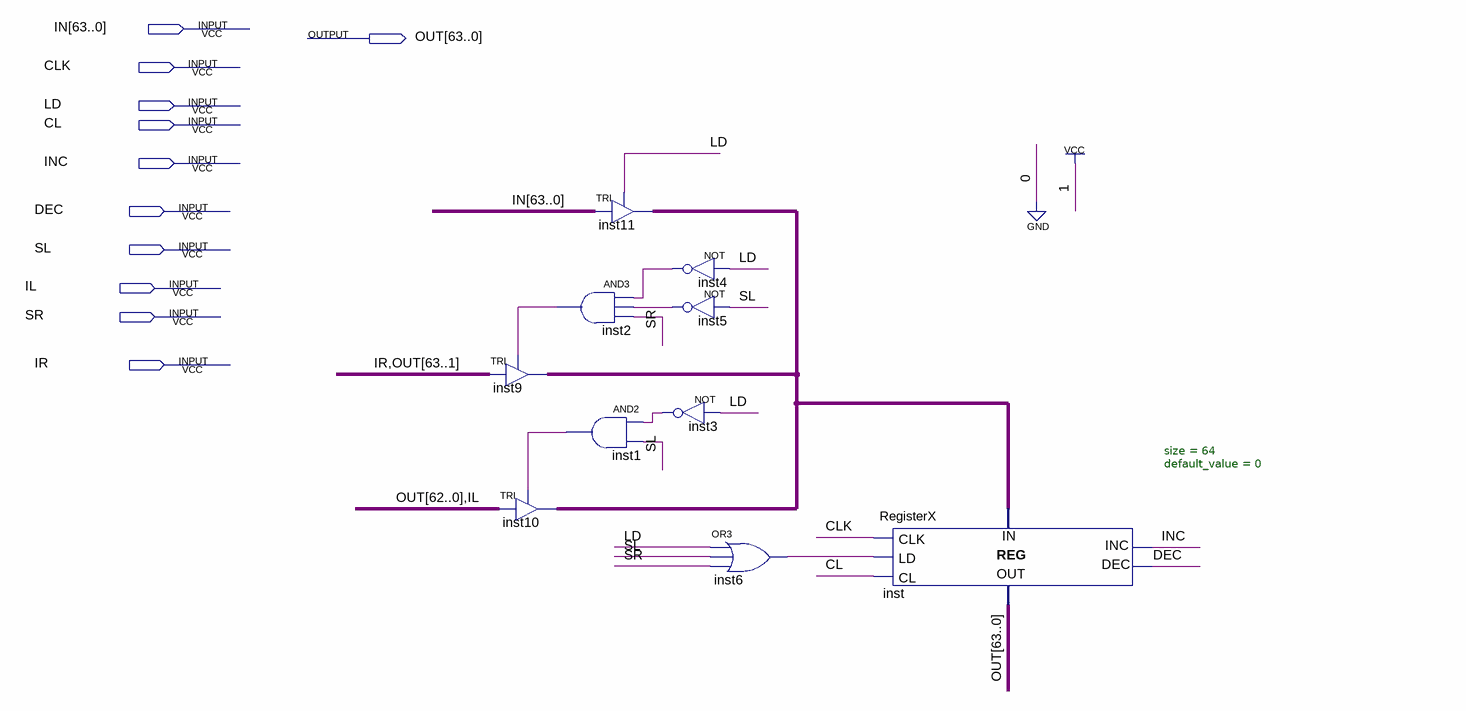
[diagram p0: schematic sheet]
// Quartus schematic Register64_SHIFT.bdf as structural Verilog: 10 symbols, 11 pins
module Register64_SHIFT (
  input  [63:0] IN,
  input  CLK,
  input  LD,
  input  CL,
  input  INC,
  input  DEC,
  input  SL,
  input  IL,
  input  SR,
  input  IR,
  output [63:0] OUT
);

  wire inst1_out, inst2_out, inst3_out, inst4_out, inst5_out, inst6_out;
  wire [63:0] inst9_out;

  TRI inst9[63:0] (.IN({IR, OUT[63:1]}), .OE(inst2_out), .OUT(inst9_out));
  TRI inst10[63:0] (.IN({OUT[62:0], IL}), .OE(inst1_out), .OUT(inst9_out));
  and inst2 (inst2_out, inst4_out, inst5_out, SR);
  and inst1 (inst1_out, inst3_out, SL);
  TRI inst11[63:0] (.IN(IN), .OE(LD), .OUT(inst9_out));
  not inst4 (inst4_out, LD);
  not inst5 (inst5_out, SL);
  not inst3 (inst3_out, LD);
  or inst6 (inst6_out, LD, SL, SR);
  RegisterX #(.size(64), .default_value(0)) inst (
    .CLK(CLK), .LD(inst6_out), .CL(CL), .INC(INC), .DEC(DEC), .DATA_IN(inst9_out), .DATA_OUT(OUT));
endmodule
